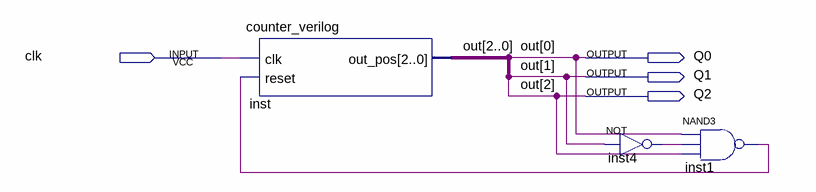
[diagram p0: schematic sheet]
// Quartus schematic CNT_v.bdf as structural Verilog: 3 symbols, 4 pins
module CNT_v (
  input  clk,
  output Q0,
  output Q1,
  output Q2
);

  wire inst1_out, inst4_out;

  counter_verilog inst (.clk(clk), .reset(inst1_out), .out_pos({Q2, Q1, Q0}));
  not inst4 (inst4_out, Q1);
  nand inst1 (inst1_out, Q0, inst4_out, Q2);

  // Other names for the same wires on the sheet: out[2:0] = {Q2, Q1, Q0}
endmodule
